# Altium project Breakout_16pin.PrjPcb
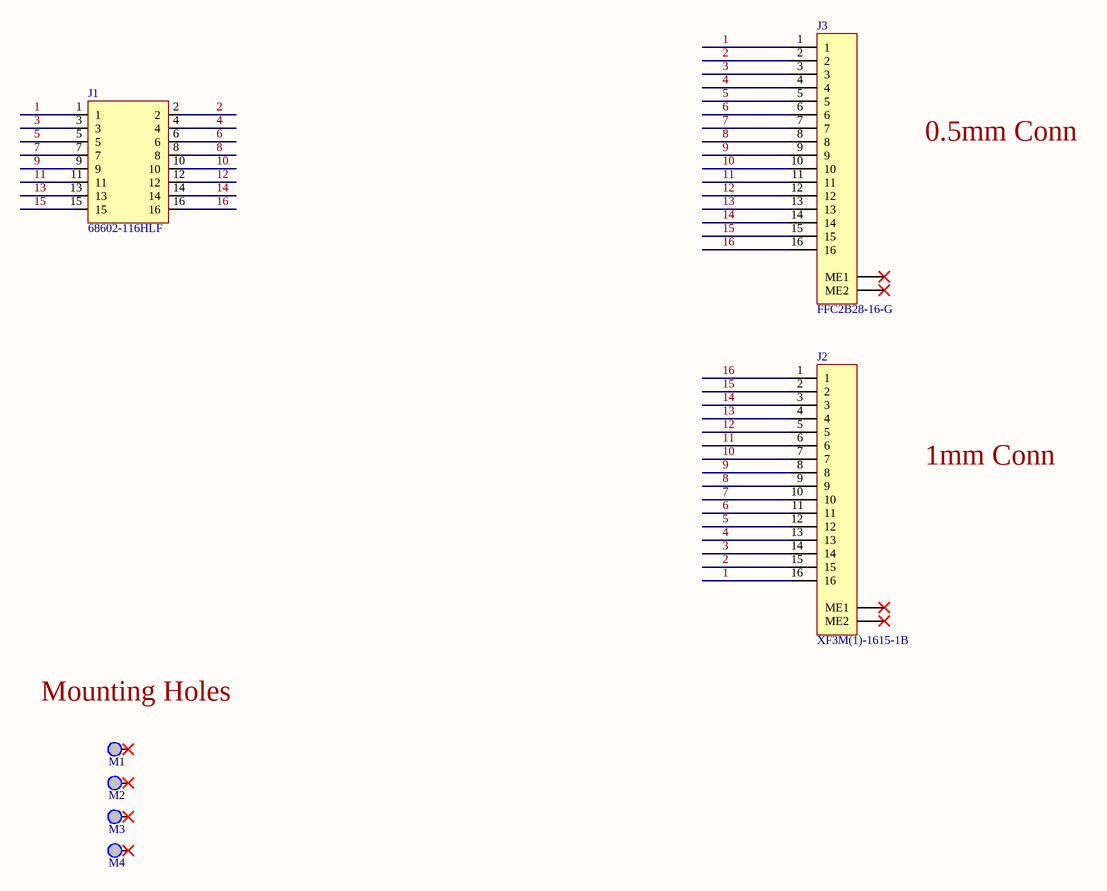
[diagram p0: Main.SchDoc]
Rev: A; ProjectName: Breakout_16pin
1 sheet, 7 parts. Net scope: global (net labels, ports and power ports of the same name join across sheets).
Board file: Breakout_16pin.PcbDoc

## Sheet Main.SchDoc: Breakout 16pin
size A3; Organization: INTERCREATE; Address1: 2415 3RD ST. SUITE #232; Address2: SAN FRANCISCO CA 94107; Revision: A; SheetNumber: 1; SheetTotal: 1; ProjectName: KAGWERKS COMMAND CENTER

### Parts
J1  68602-116HLF  [HDR-V-2X8-2.54MM]
J2  XF3M(1)-1615-1B  [CONN-FFC-H-16P-1MM]
J3  FFC2B28-16-G  [CONN-FFC-H-16P-0.5MM]
M1  MTG_HOLE  [MH_P_2.5MM]  (value not drawn)  (no BOM)
M2  MTG_HOLE  [MH_P_2.5MM]  (value not drawn)  (no BOM)
M3  MTG_HOLE  [MH_P_2.5MM]  (value not drawn)  (no BOM)
M4  MTG_HOLE  [MH_P_2.5MM]  (value not drawn)  (no BOM)

### Nets
1: J1.1 J2.16 J3.1
2: J1.2 J2.15 J3.2
3: J1.3 J2.14 J3.3
4: J1.4 J2.13 J3.4
5: J1.5 J2.12 J3.5
6: J1.6 J2.11 J3.6
7: J1.7 J2.10 J3.7
8: J1.8 J2.9 J3.8
9: J1.9 J2.8 J3.9
10: J1.10 J2.7 J3.10
11: J1.11 J2.6 J3.11
12: J1.12 J2.5 J3.12
13: J1.13 J2.4 J3.13
14: J1.14 J2.3 J3.14
15: J1.15 J2.2 J3.15
16: J1.16 J2.1 J3.16

Not connected (* = marked no-connect by the designer): J2 ME1* ME2*; J3 ME1* ME2*; M1 1*; M2 1*; M3 1*; M4 1*

### Notes on the sheet
- 0.5mm Conn
- 1mm Conn
- (near M1) Mounting Holes
- Title
- Size:
- Date:
- A3
- Number:
- Time:
- Revision:
- Sheet
- of
- File:

### Library data of the parts
J1 = HDR-V-2X8-M-2.54MM: Conn Unshrouded Header HDR 16 POS 2.54mm Solder ST Top Entry Thru-Hole BergStik® Bulk; Manufacturer 1: Amphenol ICC / FCI; Number of Contacts: 16; Current Rating: 3A; Voltage Rating: 1.5kV; Insulation Resistance: 5GR; Gender: Male; Row Spacing: 0.1inch; Contact Post Length: 3.81mm; Supplier: Newark; Supplier Part Number: 38AH4644; Manufacturer Part Number 1: 68602-116HLF; RoHS: Yes; Category: Headers and Wire Housings; Stock: 800; Pricing: 1=1.38, 10=1.13, 25=1.12, 50=1.08, 100=1.07, 250=0.991, 300=0.991, 500=0.909, 1000=0.826 (USD); Mounting Technology: Through Hole; Contact Plating: Gold,GXT; Contact Material: Bronze; Color: Black; Housing Color: Black; Housing Material: Thermoplastic; Min Operating Temperature: -65°C; Max Operating Temperature: 125°C; Number of Rows: 2; Termination: Solder; Packaging: Bulk; Package Quantity: 100; Contact Gender: Male; Number of Positions: 16; Max Voltage Rating (AC): 1.5kV; Orientation: Straight; Series: BERGSTIK® II, MezzSelect™, Basics+; Contact Type: Male Pin; Length: 20.32mm; Pitch: 2.54mm; Contact Mating Length: 0.23inch; Depth: 4.83mm; Radiation Hardening: No; Reach SVHC Compliant: No; Flammability Rating: UL94 V-0; RoHS Compliant: Yes; ComponentLink1URL: https://datasheet.ciiva.com/5157/67996-225486-5157197.pdf?src-supplier=Mouser; ComponentLink1Description: https://datasheet.ciiva.com/5157/67996-225486-5157197.pdf?src-supplier=Mouser; ComponentLink2URL: https://datasheet.ciiva.com/9465/67996-9465931.pdf?src-supplier=Avnet; ComponentLink2Description: https://datasheet.ciiva.com/9465/67996-9465931.pdf?src-supplier=Avnet; ComponentLink3URL: https://datasheet.ciiva.com/728/67996-728940.pdf?src-supplier=Digi-Key; ComponentLink3Description: https://datasheet.ciiva.com/728/67996-728940.pdf?src-supplier=Digi-Key
J2 = CONN-FFC-H-16P-1MM: 1.0-mm Pitch, Dual Contact ; For FPC/FFC, 16 Contacts, RoHS; Manufacturer 1: Omron; Actuator Material: Polymer,Liquid Crystal Polymer; Actuator Color: Black; Number of Positions: 16; Voltage Rating: 50V; Current Rating: 500mA; Mating Cycles: 20; Pitch: 0.039inch; Supplier: Digi-Key; Supplier Part Number: Z5876CT-ND; Manufacturer Part Number 1: XF3M(1)-1615-1B; RoHS: Yes; Category: FFC / FPC; Stock: 1621; Pricing: 1=1.77, 10=1.542, 25=1.476, 50=1.4432, 100=1.3776, 250=1.2464, 500=1.148 (USD); Mounting Technology: Surface Mount; Contact Material: Copper Alloy; Contact Plating: Gold; Housing Material: Polymer; Housing Color: Natural; Min Operating Temperature: -30°C; Max Operating Temperature: 85°C; Number of Rows: 1; Packaging: Tape and Reel; Termination: Solder; Orientation: Right Angle; Series: XF3M; Package Quantity: 1500; Flammability Rating: UL94 V-0; RoHS Compliant: Yes; ComponentLink1URL: http://datasheet.octopart.com/XF3M%281%29-1615-1B-Omron-datasheet-62282188.pdf?src-supplier=Onlinecomponents.com; ComponentLink1Description: http://datasheet.octopart.com/XF3M%281%29-1615-1B-Omron-datasheet-62282188.pdf?src-supplier=Onlinecomponents.com; ComponentLink2URL: http://datasheet.octopart.com/XF3M%281%29-1615-1B-Omron-datasheet-62282188.pdf?src-supplier=Allied+Electronics; ComponentLink2Description: http://datasheet.octopart.com/XF3M%281%29-1615-1B-Omron-datasheet-62282188.pdf?src-supplier=Allied+Electronics; ComponentLink3URL: http://datasheet.octopart.com/XF3M%281%29-1615-1B-Omron-datasheet-62282188.pdf?src-supplier=Avnet; ComponentLink3Description: http://datasheet.octopart.com/XF3M%281%29-1615-1B-Omron-datasheet-62282188.pdf?src-supplier=Avnet; ComponentLink4URL: http://datasheet.octopart.com/XF3M%281%29-1615-1B-Omron-datasheet-62282188.pdf?src-supplier=Mouser; ComponentLink4Description: http://datasheet.octopart.com/XF3M%281%29-1615-1B-Omron-datasheet-62282188.pdf?src-supplier=Mouser; ComponentLink5URL: http://www.omron.com/ecb/products/pdf/en-xf3m.pdf?src-supplier=Digi-Key; ComponentLink5Description: http://www.omron.com/ecb/products/pdf/en-xf3m.pdf?src-supplier=Digi-Key; ComponentLink6URL: http://datasheet.octopart.com/XF3M%281%29-1615-1B-Omron-datasheet-62282188.pdf?src-supplier=Digi-Key; ComponentLink6Description: http://datasheet.octopart.com/XF3M%281%29-1615-1B-Omron-datasheet-62282188.pdf?src-supplier=Digi-Key; ComponentLink7URL: http://datasheet.octopart.com/XF3M%281%29-1615-1B-Omron-datasheet-62282188.pdf?src-supplier=Verical; ComponentLink7Description: http://datasheet.octopart.com/XF3M%281%29-1615-1B-Omron-datasheet-62282188.pdf?src-supplier=Verical; ComponentLink8URL: http://datasheet.octopart.com/XF3M%281%29-1615-1B-Omron-datasheet-62282188.pdf?src-supplier=Newark; ComponentLink8Description: http://datasheet.octopart.com/XF3M%281%29-1615-1B-Omron-datasheet-62282188.pdf?src-supplier=Newark; ComponentLink9URL: https://datasheet.octopart.com/XF3M%281%29-1615-1B-Omron-datasheet-62282188.pdf?src-supplier=Master+Electronics; ComponentLink9Description: https://datasheet.octopart.com/XF3M%281%29-1615-1B-Omron-datasheet-62282188.pdf?src-supplier=Master+Electronics; ComponentLink10URL: http://datasheet.octopart.com/XF3M%281%29-1615-1B-Omron-datasheet-62282188.pdf?src-supplier=Sager+Electronics; ComponentLink10Description: http://datasheet.octopart.com/XF3M%281%29-1615-1B-Omron-datasheet-62282188.pdf?src-supplier=Sager+Electronics; ComponentLink11URL: http://datasheet.octopart.com/XF3M%281%29-1615-1B-Omron-datasheet-62282188.pdf?src-supplier=Heilind+Electronics; ComponentLink11Description: http://datasheet.octopart.com/XF3M%281%29-1615-1B-Omron-datasheet-62282188.pdf?src-supplier=Heilind+Electronics
J3 = CONN-FFC-H-16P-0.5MM: 16 Position FFC, FPC Connector Contacts, Top and Bottom 0.020" (0.50mm) Surface Mount, Right Angle; Manufacturer 1: Global Connector Technology; Pitch: 0.5mm; Number of Positions: 16; Manufacturer Part Number 1: FFC2B28-16-G
M1-M4 = MTG_HOLE: MTG HOLE PLATED VARIOUS SIZES

## Assembly variants
Mfg: not fitted J1 J1 J1 J1 J1 J1 J1 J1